# EAGLE design power (EAGLE 9.6.2)
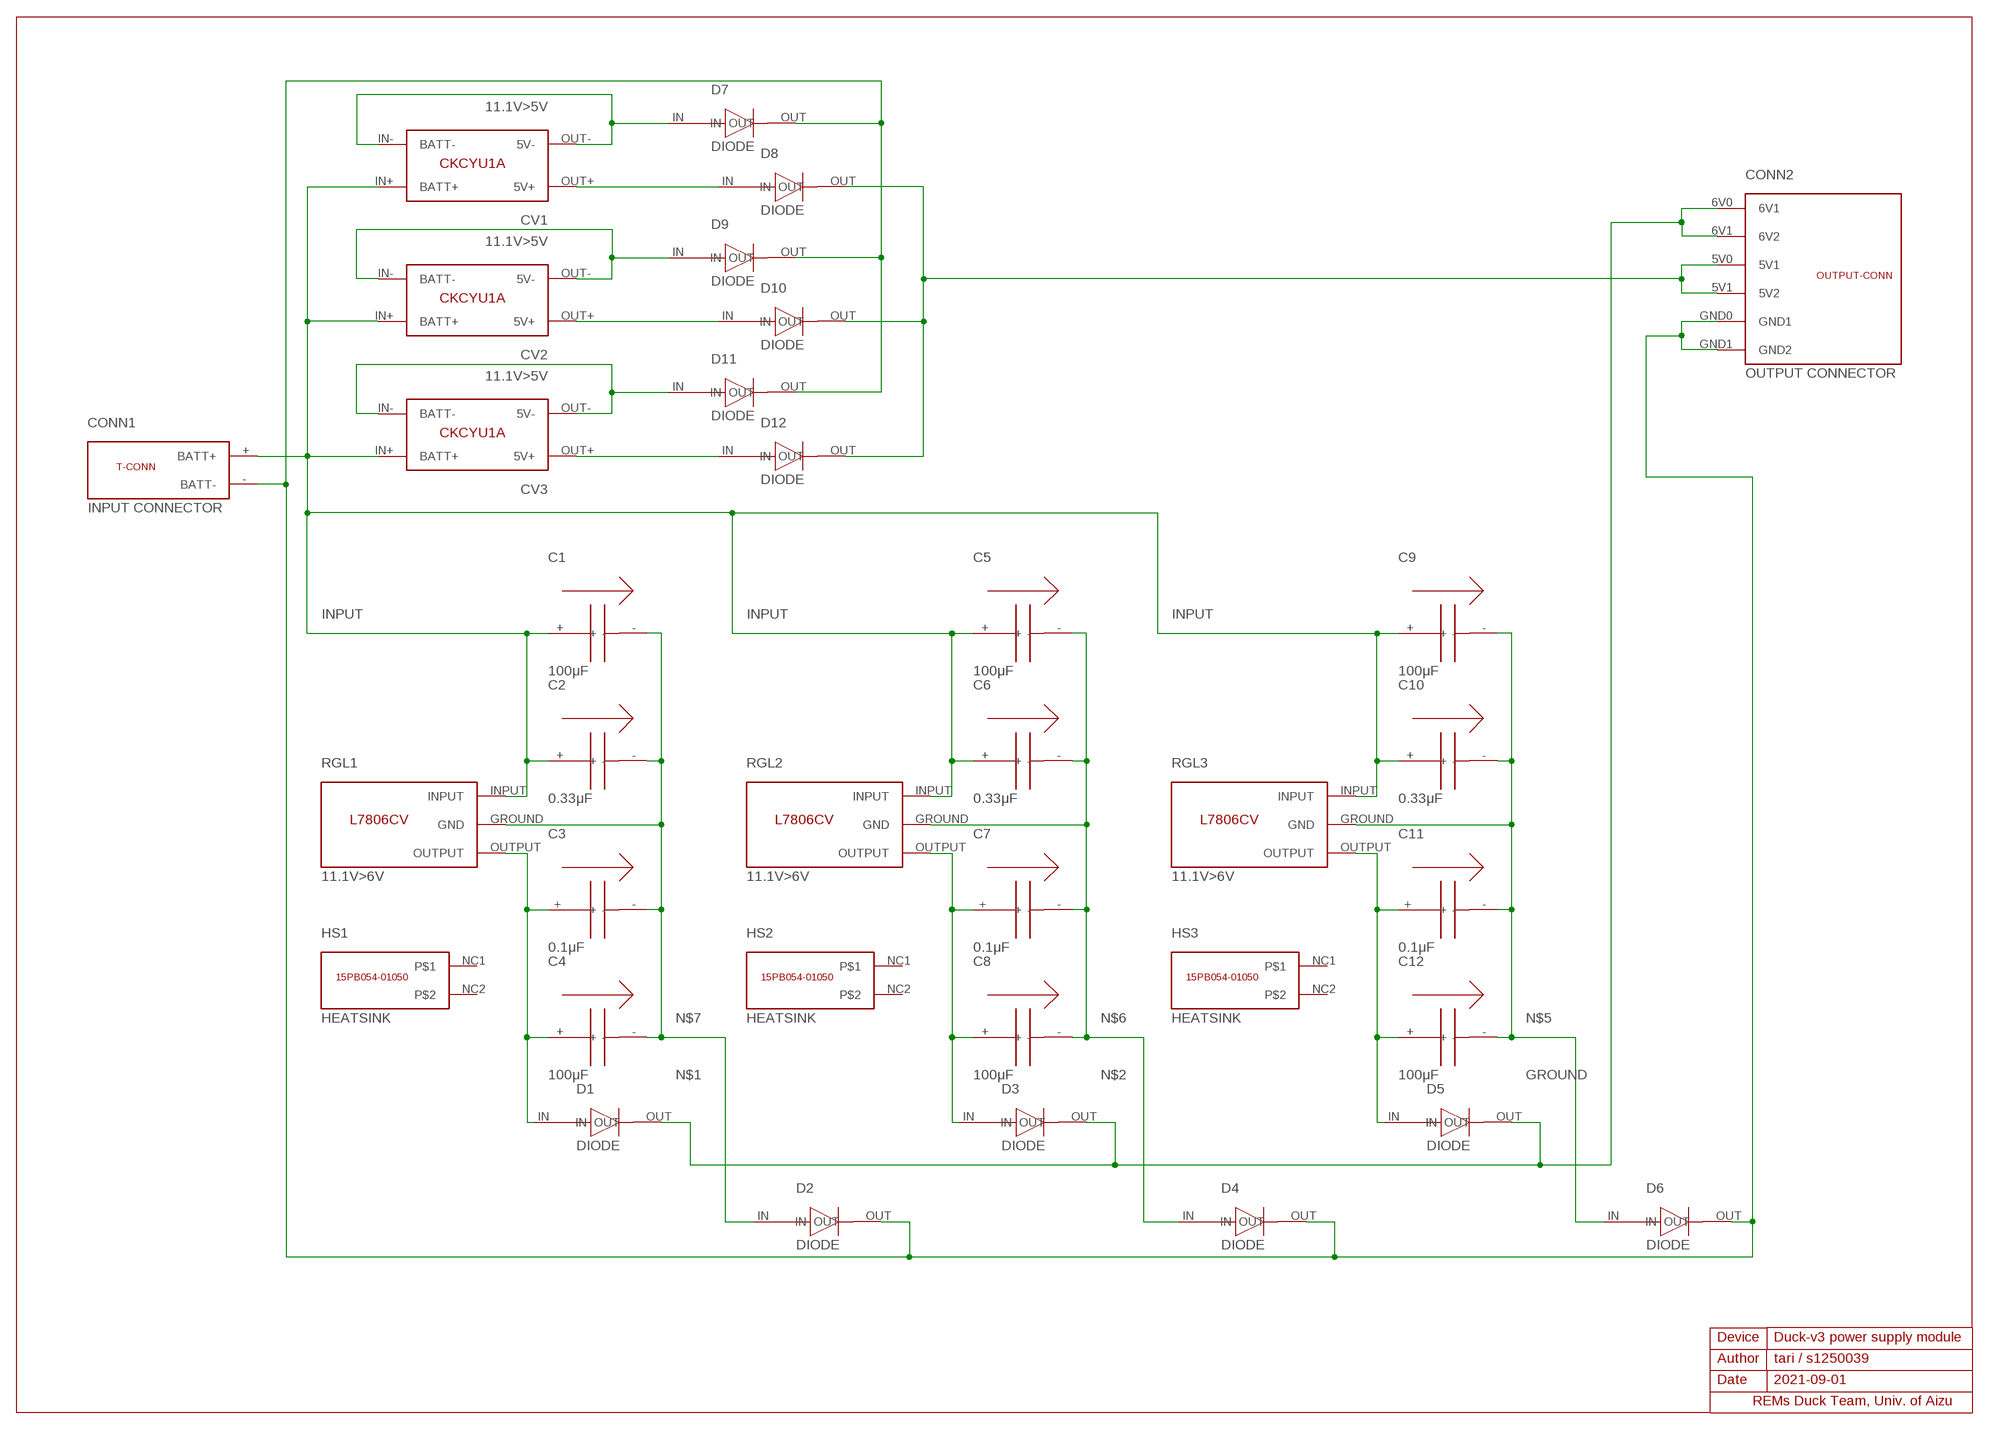
[diagram p0: schematic, sheet 1]

## Parts
C1  100μF  C-100μF  [C-100μF]
C2  0.33μF  C-0.33μF  [C-0.33μF]
C3  0.1μF  C-0.1μF  [C-0.1μF]
C4  100μF  C-100μF  [C-100μF]
C5  100μF  C-100μF  [C-100μF]
C6  0.33μF  C-0.33μF  [C-0.33μF]
C7  0.1μF  C-0.1μF  [C-0.1μF]
C8  100μF  C-100μF  [C-100μF]
C9  100μF  C-100μF  [C-100μF]
C10  0.33μF  C-0.33μF  [C-0.33μF]
C11  0.1μF  C-0.1μF  [C-0.1μF]
C12  100μF  C-100μF  [C-100μF]
CONN1  INPUT CONNECTOR  T-CONN  [T-CONN]
CONN2  OUTPUT CONNECTOR  OUTPUT-CONN  [OUTPUT-CONN]
CV1  11.1V>5V  CKCYU1A  [CKCYU1A]
CV2  11.1V>5V  CKCYU1A  [CKCYU1A]
CV3  11.1V>5V  CKCYU1A  [CKCYU1A]
D1  DIODE  [DIODE]
D2  DIODE  [DIODE]
D3  DIODE  [DIODE]
D4  DIODE  [DIODE]
D5  DIODE  [DIODE]
D6  DIODE  [DIODE]
D7  DIODE  [DIODE]
D8  DIODE  [DIODE]
D9  DIODE  [DIODE]
D10  DIODE  [DIODE]
D11  DIODE  [DIODE]
D12  DIODE  [DIODE]
HS1  HEATSINK  15PB054-01050  [15PB054-01050]
HS2  HEATSINK  15PB054-01050  [15PB054-01050]
HS3  HEATSINK  15PB054-01050  [15PB054-01050]
RGL1  11.1V>6V  L7806CV  [L7806CV]
RGL2  11.1V>6V  L7806CV  [L7806CV]
RGL3  11.1V>6V  L7806CV  [L7806CV]

## Nets
5V: CV3.OUT+(5V+) D12.IN
GROUND: CONN1.-(BATT-) CONN2.GND0(GND1) CONN2.GND1(GND2) D2.OUT D4.OUT D6.OUT D7.OUT D9.OUT D11.OUT
INPUT: C1.+ C2.+ C5.+ C6.+ C9.+ C10.+ CONN1.+(BATT+) CV1.IN+(BATT+) CV2.IN+(BATT+) CV3.IN+(BATT+) RGL1.INPUT RGL2.INPUT RGL3.INPUT
N$1: C3.＋(+) C4.+ D1.IN RGL1.OUTPUT
N$2: C7.＋(+) C8.+ D3.IN RGL2.OUTPUT
N$3: CV3.IN-(BATT-) CV3.OUT-(5V-) D11.IN
N$4: CONN2.6V0(6V1) CONN2.6V1(6V2) D1.OUT D3.OUT D5.OUT
N$5: C9.- C10.- C11.- C12.- D6.IN RGL3.GROUND(GND)
N$6: C5.- C6.- C7.- C8.- D4.IN RGL2.GROUND(GND)
N$7: C1.- C2.- C3.- C4.- D2.IN RGL1.GROUND(GND)
N$8: C11.＋(+) C12.+ D5.IN RGL3.OUTPUT
N$9: CV2.IN-(BATT-) CV2.OUT-(5V-) D9.IN
N$10: CONN2.5V0(5V1) CONN2.5V1(5V2) D8.OUT D10.OUT D12.OUT
N$11: CV1.IN-(BATT-) CV1.OUT-(5V-) D7.IN
N$12: CV1.OUT+(5V+) D8.IN
N$13: CV2.OUT+(5V+) D10.IN
Unconnected: HS1.NC1 HS1.NC2 HS2.NC1 HS2.NC2 HS3.NC1 HS3.NC2

## Notes on the sheet
- Device | Duck-v3 power supply module
- Author | tari / s1250039
- Date | 2021-09-01
- REMs Duck Team, Univ. of Aizu

## Library data of the parts
C1 C4 C5 C8 C9 C12 = library:C-100μF
C2 C6 C10 = library:C-0.33μF
C3 C7 C11 = library:C-0.1μF
CONN1 = library:T-CONN
CONN2 = library:OUTPUT-CONN
CV1-CV3 = library:CKCYU1A
D1-D12 = library:DIODE
HS1-HS3 = library:15PB054-01050
RGL1-RGL3 = library:L7806CV

## Board
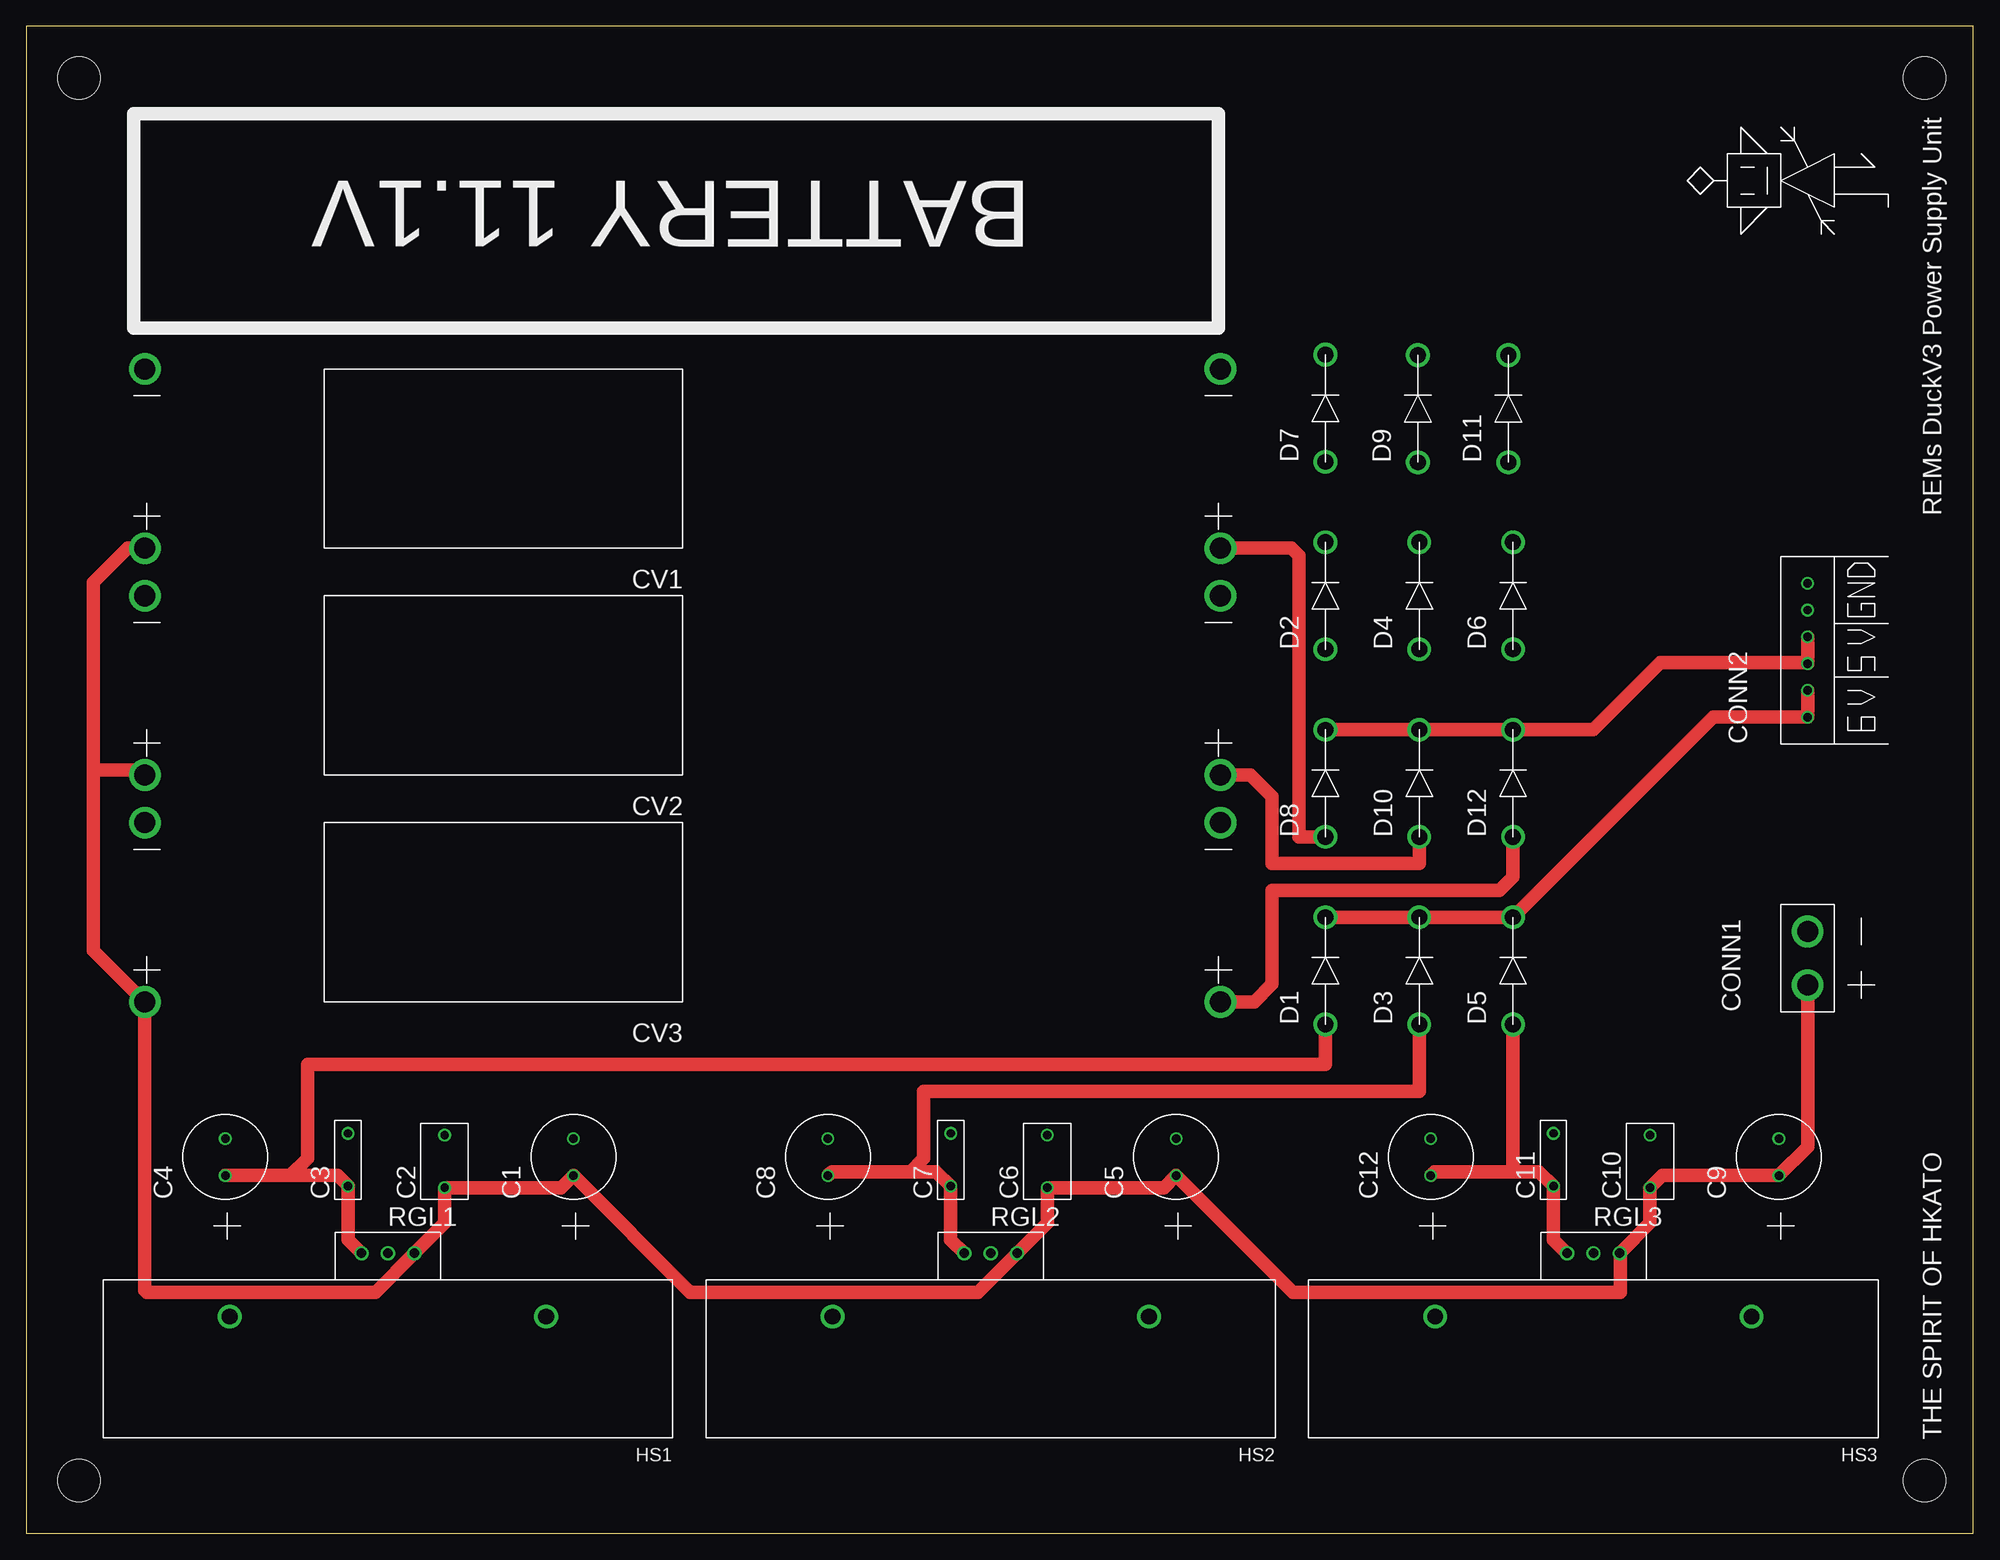
[diagram p1: board, top side]
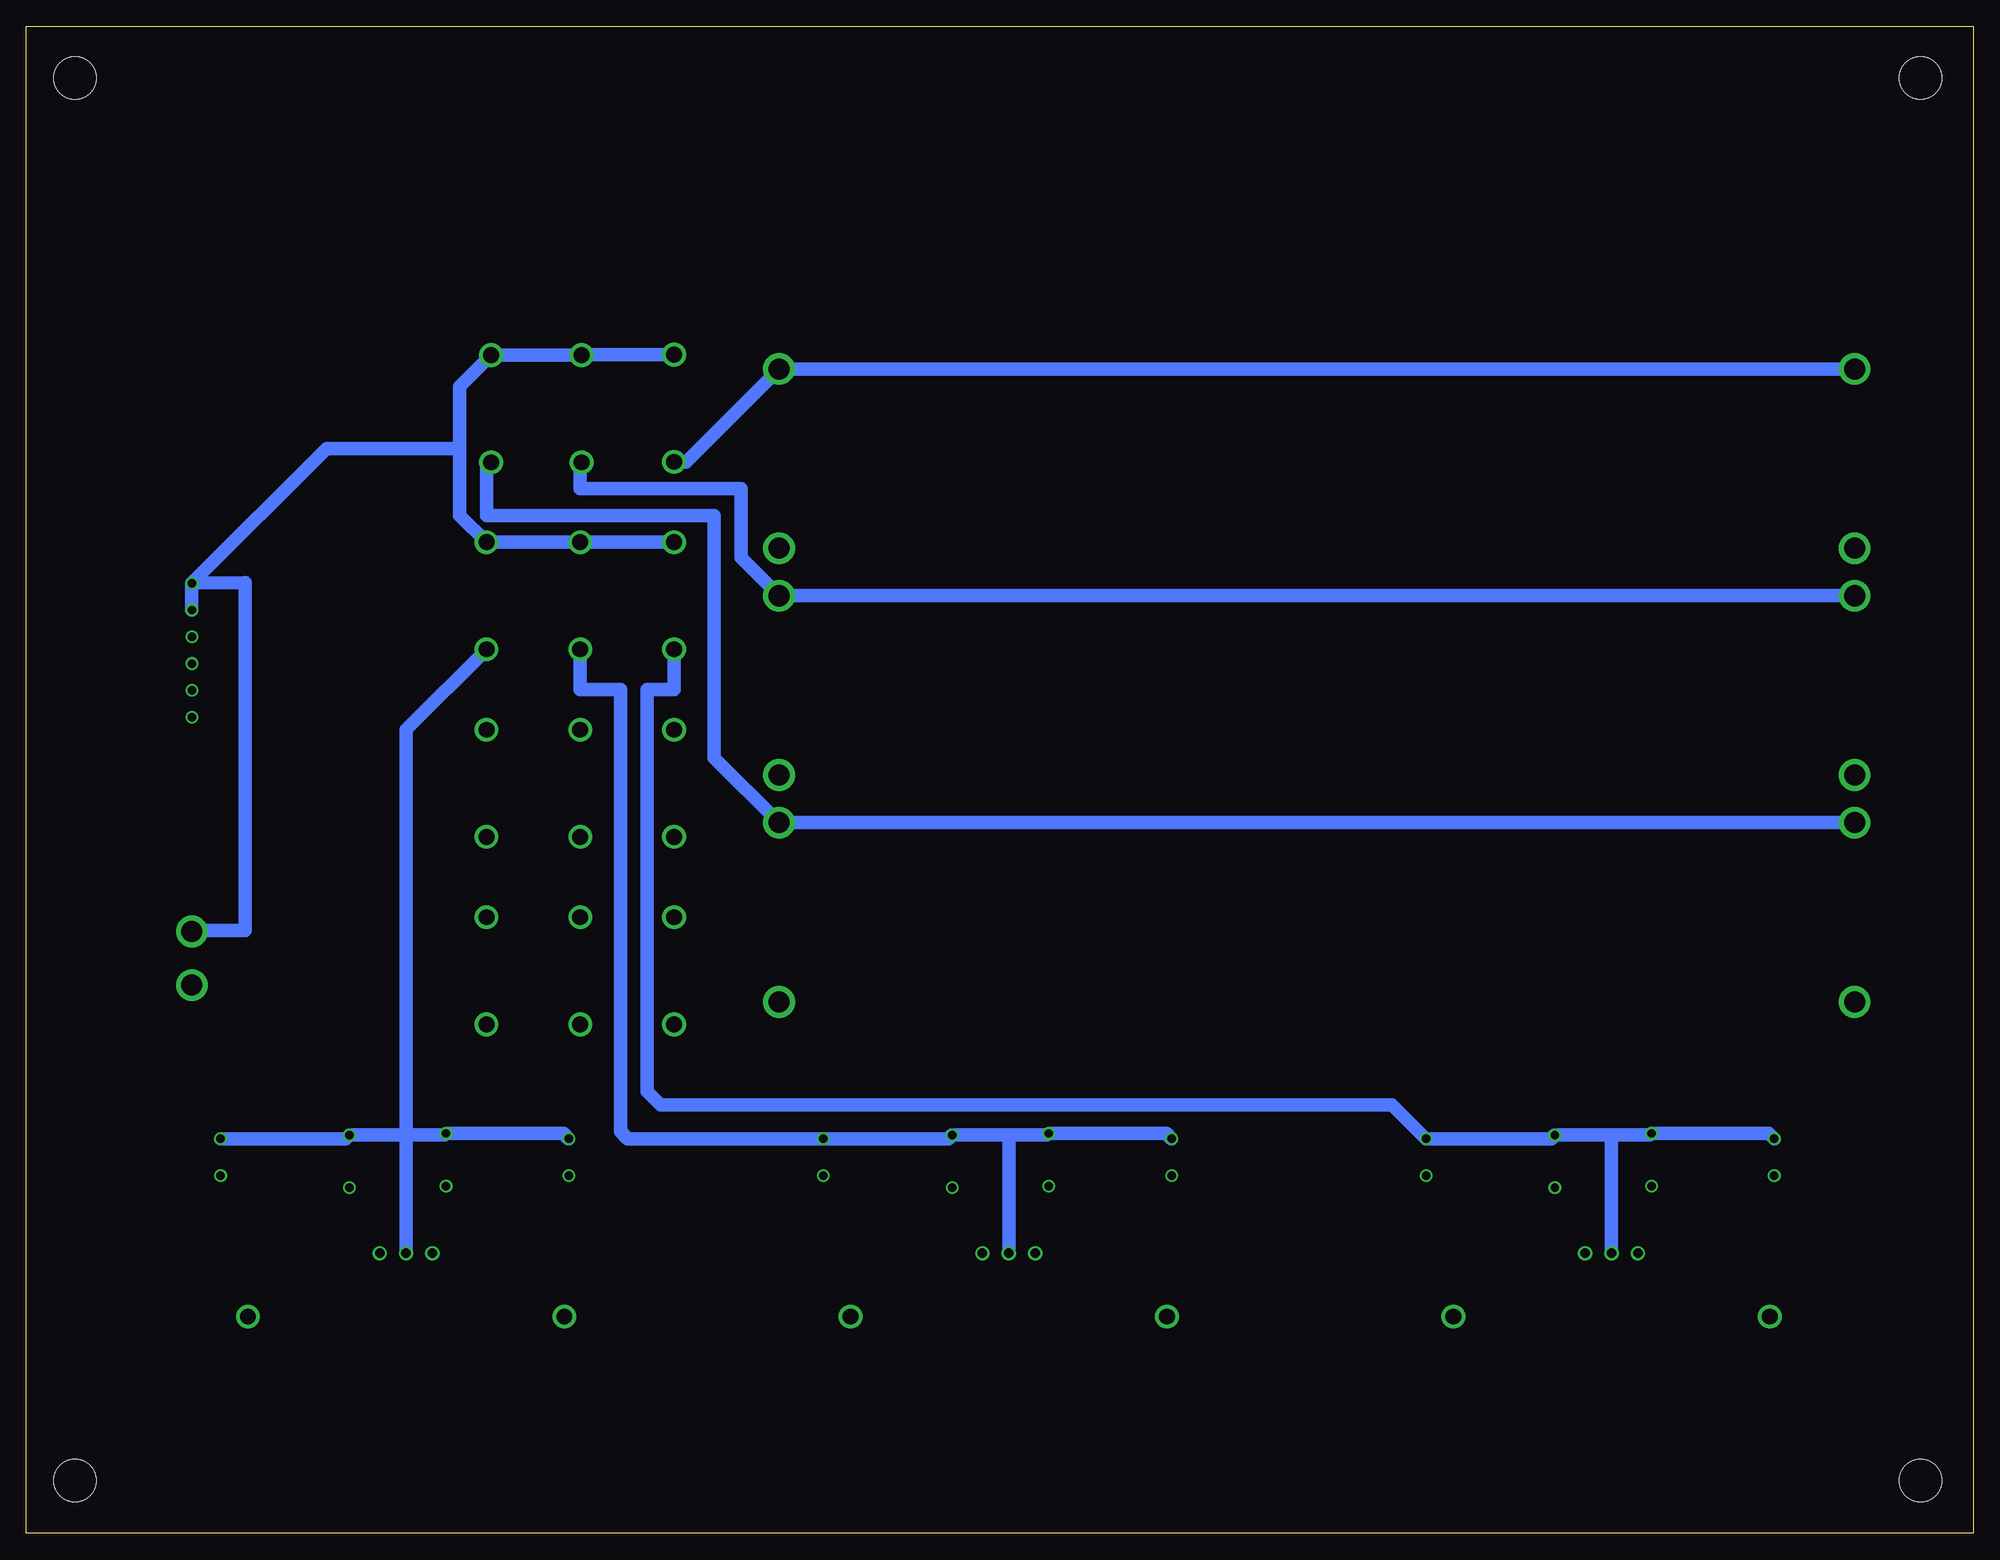
[diagram p2: board, bottom side, seen from below]

Size 184.6 x 142.9 mm. Coordinates in mm from the lower left corner, seen from the top.
Outline: 0,0 184.6,0 184.6,142.9 0,142.9 0,0
Copper layers (1*16): Top 0.035mm / dielectric 1.6mm / Bottom 0.035mm
Design rules "Elecrow_2-layer_PCB_eagle_rule": minimum track width 6mil, minimum drill 12mil, track to track 6mil, track to pad 6mil, pad to pad 6mil, via to via 8mil, smd to smd 0mil, copper to edge 20mil, drill to drill 10mil, minimum pad ring 6mil, minimum via ring 6mil, stop-mask expansion 0mil, vias tented up to drill 100mil, thermal gap 10mil
Holes 4 mm at 5,5 180,5 5,138 180,138

### Footprints (pad centres in the part's own frame; a part is rotated, then mirrored left to right if it is on the bottom)
C-100μF = drill 0.8: + 2.25,4; - 5.75,4
C-0.33μF = drill 0.8: + 1.1,2.25; - 6.1,2.25
C-0.1μF = drill 0.8: - 6.25,1.25; ＋ 1.25,1.25
T-CONN = drill 2: + 2.54,2.54; - 7.62,2.54
OUTPUT-CONN = drill 0.8: 5V0 7.62,2.54; 5V1 10.16,2.54; 6V0 2.54,2.54; 6V1 5.08,2.54; GND0 12.7,2.54; GND1 15.24,2.54
CKCYU1A = drill 2: IN+ 51,17; IN- 51,0; OUT+ -51,17; OUT- -51,0
DIODE = drill 1.5: IN 0,1.27; OUT 10.16,1.27
15PB054-01050 = drill 1.5: NC1 -15,3.5; NC2 15,3.5
L7806CV = drill 0.9: GROUND 0,2.5; INPUT 2.5,2.5; OUTPUT -2.5,2.5

### Placement (x,y rotation side)
C1  55.88,31.67 90 top
C2  41.91,31.67 90 top
C3  31.75,31.67 90 top
C4  22.86,31.67 90 top
C5  113.03,31.67 90 top
C6  99.06,31.67 90 top
C7  88.9,31.67 90 top
C8  80.01,31.67 90 top
C9  170.18,31.67 90 top
C10  156.21,31.67 90 top
C11  146.05,31.67 90 top
C12  137.16,31.67 90 top
CONN1  171.45,49.45 90 top
CONN2  171.45,74.85 90 top
CV1  62.23,110.41 180 top
CV2  62.23,88.9 180 top
CV3  62.23,67.39 180 top
D1  124.46,48.26 90 top
D2  124.46,83.82 90 top
D3  133.35,48.26 90 top
D4  133.35,83.82 90 top
D5  142.24,48.26 90 top
D6  142.24,83.82 90 top
D7  124.46,101.6 90 top
D8  124.46,66.04 90 top
D9  133.22,101.56 90 top
D10  133.35,66.04 90 top
D11  141.79,101.56 90 top
D12  142.24,66.04 90 top
HS1  34.29,24.05 180 top
HS2  91.44,24.05 180 top
HS3  148.59,24.05 180 top
RGL1  34.29,24.05 0 top
RGL2  91.44,24.05 0 top
RGL3  148.59,24.05 0 top

### Tracks (layer width: path | path; a pad name or v marks a point on that pad's centre or on a via)
5V
  Top 1.27: D12.IN 140.97,62.23 139.7,60.96 118.11,60.96 118.11,52.07 116.43,50.39 CV3.OUT+
GROUND
  Bottom 1.27: D7.OUT 132.08,111.76 132.04,111.72 D9.OUT D11.OUT 143.51,108.73 143.51,102.87 | D2.OUT D4.OUT D6.OUT 143.51,96.52 143.51,102.87 | 143.51,102.87 156.13,102.87 CONN2.GND1 | CONN2.GND1 CONN2.GND0 | CONN2.GND1 163.83,90.17 163.83,57.15 168.91,57.15 CONN1.-
INPUT
  Top 1.27: CONN1.+ 168.91,36.65 C9.+ 155.11,33.92 C10.+ 153.96,29.42 RGL3.INPUT 151.13,26.51 151.13,22.86 120.09,22.86 C5.+ 107.88,32.77 C6.+ 96.81,29.42 RGL2.INPUT 90.25,22.86 62.94,22.86 C1.+ 50.73,32.77 C2.+ 39.66,29.42 RGL1.INPUT 33.1,22.86 11.43,22.86 11.23,23.06 CV3.IN+ 6.35,55.27 6.35,72.39 | 6.35,72.39 6.35,90.17 9.59,93.41 CV1.IN+ | 6.35,72.39 11.43,72.39 CV2.IN+
N$1
  Top 1.27: 25.03,33.92 C4.+ | D1.IN 123.19,44.45 26.67,44.45 26.67,35.56 25.03,33.92 | RGL1.OUTPUT 30.5,27.84 C3.＋ 29.5,33.92 25.03,33.92
N$2
  Top 1.27: C8.+ 76.38,34.29 83.82,34.29 | 83.82,34.29 85.09,35.56 85.09,41.91 132.08,41.91 D3.IN | RGL2.OUTPUT 87.65,27.84 C7.＋ 86.28,34.29 83.82,34.29
N$3
  Bottom 1.27: CV3.IN- CV3.OUT- 119.38,73.54 119.38,96.52 140.97,96.52 140.97,101.11 D11.IN
N$4
  Top 1.27: D1.OUT D3.OUT D5.OUT 159.94,77.39 CONN2.6V0 CONN2.6V1
N$5
  Bottom 1.27: C9.- 154.31,37.42 C10.- 148.59,37.77 | 148.59,37.77 144.95,37.77 C11.- 133.66,37.92 C12.- | RGL3.GROUND 148.59,37.77 | D6.IN 148.59,76.2 148.59,37.77
N$6
  Bottom 1.27: 91.44,37.77 C6.- 97.16,37.42 C5.- 127.59,37.42 128.27,38.1 128.27,80.01 132.08,80.01 D4.IN | 91.44,37.77 87.8,37.77 C7.- 76.51,37.92 C8.- | RGL2.GROUND 91.44,37.77
N$7
  Bottom 1.27: 34.29,37.77 C2.- 40.01,37.42 C1.- 55.1,40.64 124.46,40.64 125.73,41.91 125.73,80.01 123.19,80.01 D2.IN | 34.29,37.77 30.65,37.77 C3.- 19.36,37.92 C4.- | RGL1.GROUND 34.29,37.77
N$8
  Top 1.27: C12.+ 133.53,34.29 140.97,34.29 | 140.97,34.29 D5.IN | RGL3.OUTPUT 144.8,27.84 C11.＋ 143.43,34.29 140.97,34.29
N$9
  Bottom 1.27: CV2.IN- CV2.OUT- 116.84,92.51 116.84,99.06 132.08,99.06 132.08,101.43 D9.IN
N$10
  Top 1.27: D8.OUT D10.OUT D12.OUT 148.59,76.2 154.94,82.55 168.91,82.55 | CONN2.5V1 168.91,82.55 | CONN2.5V0 168.91,82.55
N$11
  Bottom 1.27: CV1.IN- CV1.OUT- 122.04,101.6 D7.IN
N$12
  Top 1.27: CV1.OUT+ 119.95,93.41 120.65,92.71 120.65,80.01 | 120.65,80.01 120.65,66.04 D8.IN | 120.65,80.01
N$13
  Top 1.27: CV2.OUT+ 116.06,71.9 118.11,69.85 118.11,63.5 132.08,63.5 D10.IN

### Text on the board
tPlace: BATTERY 11.1V
tNames: REMs DuckV3 Power Supply Unit | THE SPIRIT OF HKATO